# EAGLE design PIEFoundry 16-channel EIB (EAGLE 9.6.2)
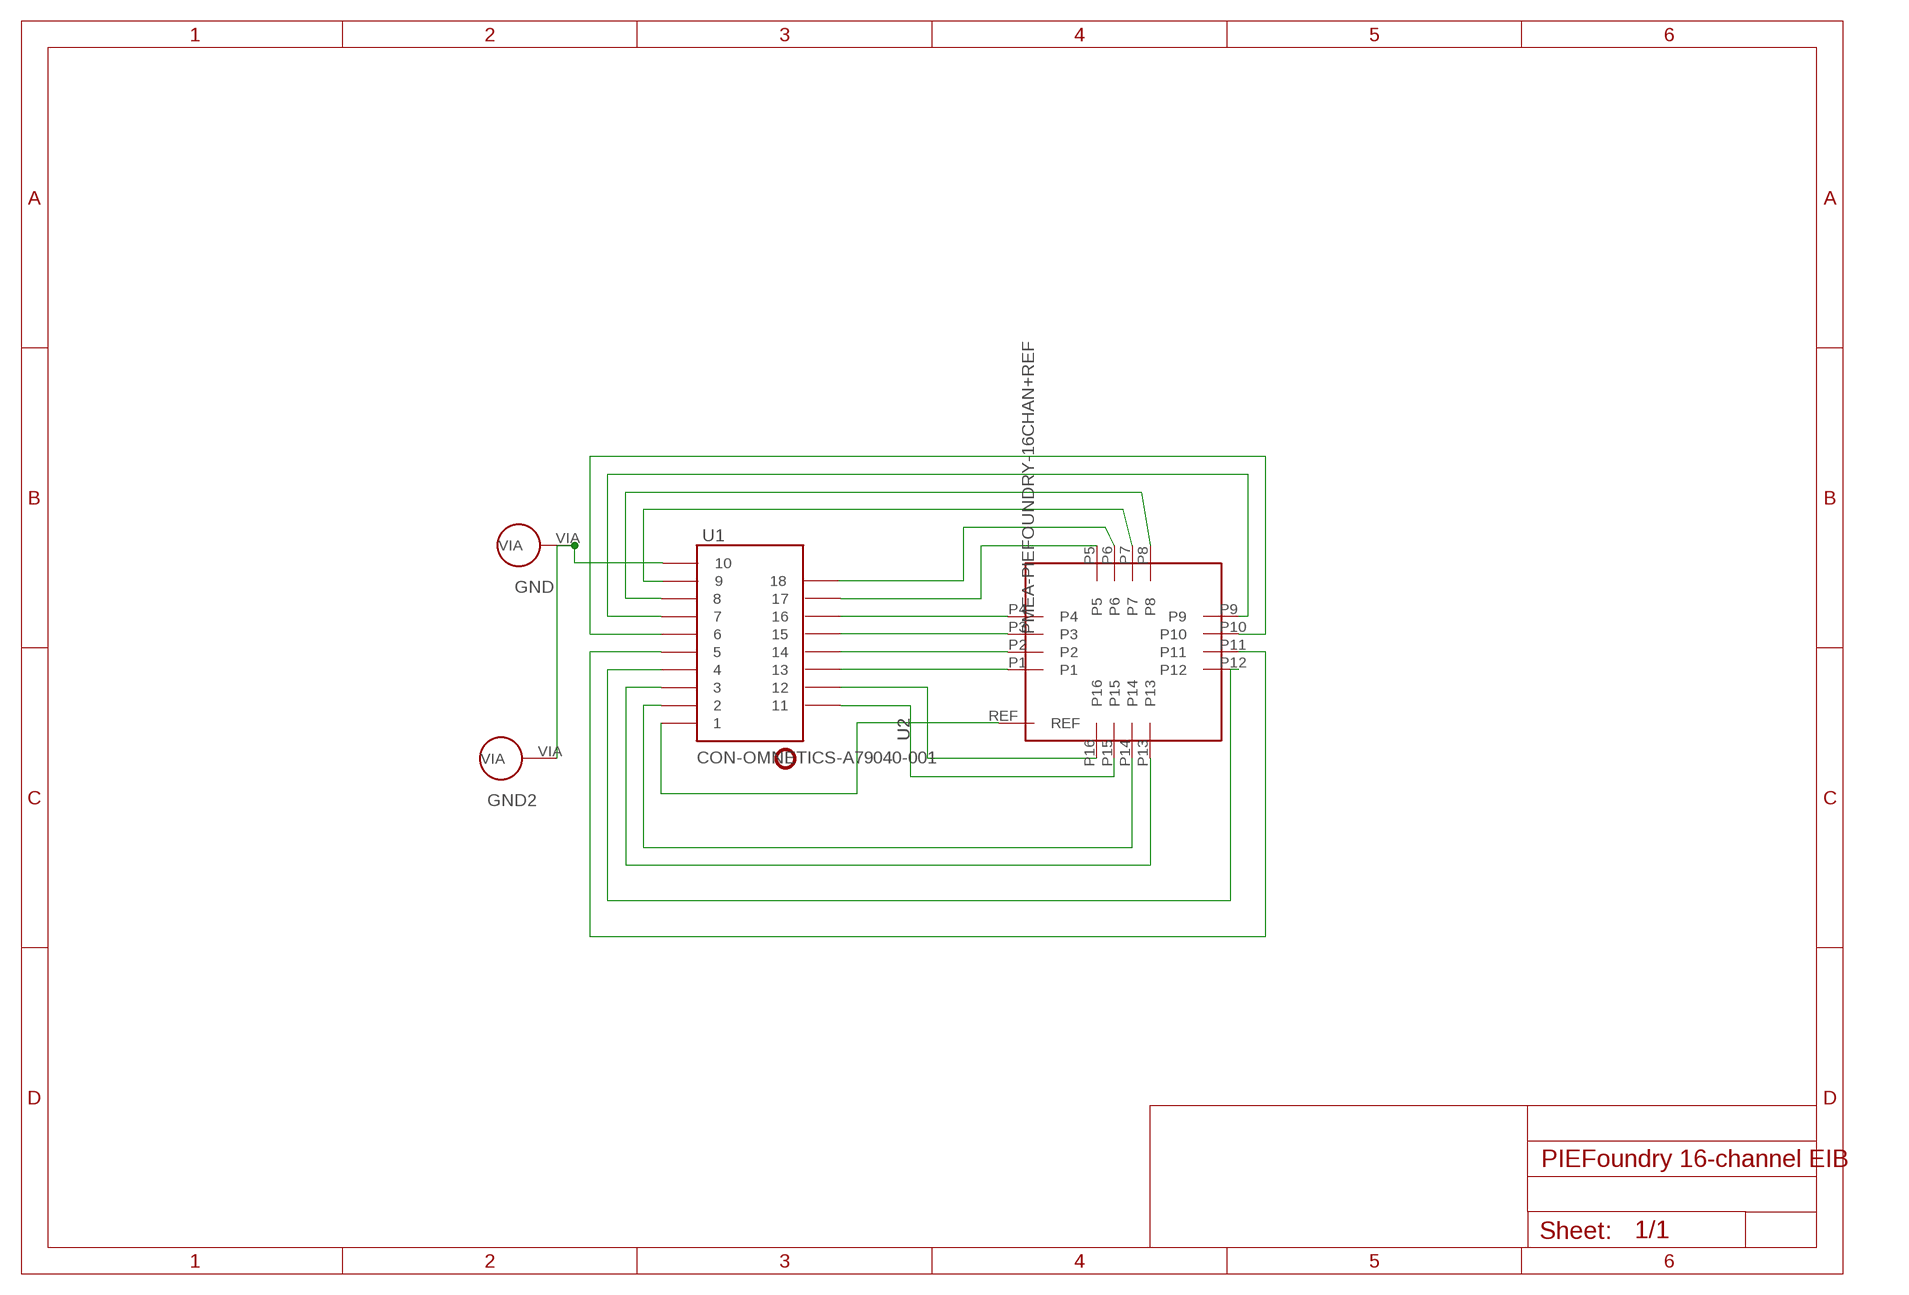
[diagram p0: schematic, sheet 1]

## Parts
GND  SOLDER_VIA_500_UM  [SOLDER_VIA_500_UM]
GND2  SOLDER_VIA_500_UM  [SOLDER_VIA_500_UM]
U1  CON-OMNETICS-A79040-001  [CON-OMNETICS-A79040-001]
U2  PMEA-PIEFOUNDRY-16CHAN+REF  [PMEA-PIEFOUNDRY-16CHAN+REF]

## Nets
GND: GND2.VIA GND.VIA U1.10
N$1: U1.13 U2.P1
N$2: U1.14 U2.P2
N$3: U1.15 U2.P3
N$4: U1.16 U2.P4
N$5: U1.12 U2.P16
N$6: U1.11 U2.P15
N$7: U1.17 U2.P5
N$8: U1.18 U2.P6
N$9: U1.2 U2.P14
N$10: U1.3 U2.P13
N$11: U1.8 U2.P8
N$12: U1.9 U2.P7
N$13: U1.4 U2.P12
N$14: U1.5 U2.P11
N$15: U1.6 U2.P10
N$16: U1.7 U2.P9
N$18: U1.1 U2.REF

## Library data of the parts
GND GND2 = VIA Connectors:SOLDER_VIA_500_UM: 500 um ID via for soldering leads
U1 = con-omnetics:CON-OMNETICS-A79040-001: 18 Position Dual Row Male Nano-Miniature (.025″/.64mm) Connector; Featuring 2 Guide Posts Holes and Horizontal Surface Mount Tails
U2 = pmea-piefoundry:PMEA-PIEFOUNDRY-16CHAN+REF: 16 channel polymer microelectrode array (pMEA) connector with integrated reference; Connection requires 17 wirebond (soft-gold) pads for ultrasonic bump bonding 3/25/25 Kee Scholten PIE Foundry @ USC

## Board
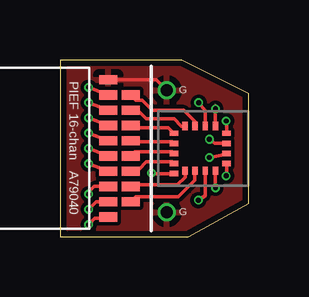
[diagram p1: board, top side]
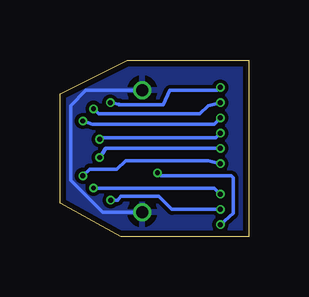
[diagram p2: board, bottom side, seen from below]

Size 7.87 x 7.37 mm. Coordinates in mm from the lower left corner, seen from the top.
Outline: 0,0 5.33,0 7.87,1.4 7.87,5.97 5.08,7.37 0,7.37 0,0
Copper layers (1*16): Top 0.035mm / dielectric 1.5mm / Bottom 0.035mm
Design rules "PIEF-11-28-23 design rules *": minimum track width 6mil, minimum drill 6mil, track to track 6mil, track to pad 6mil, pad to pad 6mil, via to via 6mil, smd to smd 6mil, copper to edge 10mil, drill to drill 15mil, minimum pad ring 3mil, minimum via ring 3mil, stop-mask expansion 4mil, vias tented up to drill 8mil, thermal gap 10mil

### Footprints (pad centres in the part's own frame; a part is rotated, then mirrored left to right if it is on the bottom)
SOLDER_VIA_500_UM = drill 0.5: VIA 0,0
CON-OMNETICS-A79040-001 = smd 0.762 x 0.381: 1 1.88,-2.857; 2 1.88,-2.223; 3 1.88,-1.587; 4 1.88,-0.953; 5 1.88,-0.318; 6 1.88,0.318; 7 1.88,0.953; 8 1.88,1.587; 9 1.88,2.223; 10 1.88,2.857; 11 2.819,-2.223; 12 2.819,-1.587; 13 2.819,-0.953; 14 2.819,-0.318; 15 2.819,0.318; 16 2.819,0.953; 17 2.819,1.587; 18 2.819,2.223
PMEA-PIEFOUNDRY-16CHAN+REF = smd 0.225 x 0.35: P1 -0.63,1.1; P2 -0.21,1.1; P3 0.21,1.1; P4 0.63,1.1; P9 0.63,-1.1; P10 0.21,-1.1; P11 -0.21,-1.1; P12 -0.63,-1.1; REF -1.05,1.1 | smd 0.35 x 0.225: P5 0.93,0.63; P6 0.93,0.21; P7 0.93,-0.21; P8 0.93,-0.63; P13 -0.93,-0.63; P14 -0.93,-0.21; P15 -0.93,0.21; P16 -0.93,0.63

### Placement (x,y rotation side)
GND  4.44,6.1 0 top
GND2  4.44,1.02 0 top
U1  0.13,3.68 0 top
U2  5.84,3.68 90 top

### Tracks (layer width: path | path; a pad name or v marks a point on that pad's centre or on a via)
GND
  Top 0.152: U1.10 4,6.54 GND.VIA
  Bottom 0.152: GND2.VIA 6.1,1.02 7.43,2.35 7.43,5.46 6.79,6.1 GND.VIA
  pour Top (isolate 0.076): 0,7.37 0,0 5.46,0 7.87,1.4 7.87,5.97 5.08,7.37
  pour Bottom (isolate 0.076): 0,7.37 0,0 5.33,0 7.87,1.4 7.87,5.97 5.08,7.37
N$1
  Top 0.152: U2.P1 4.68,3.12 3.59,3.12 3.29,2.82 3.16,2.82 3.07,2.73 U1.13
N$2
  Top 0.152: U2.P2 4.68,3.54 3.12,3.54 U1.14
N$3
  Top 0.152: U2.P3 4.68,3.96 2.99,3.96 U1.15
N$4
  Top 0.152: U2.P4 4.51,4.55 3.04,4.55 U1.16
N$5
  Top 0.152: U2.P16 5.21,2.49 4.88,2.17 3.02,2.17 U1.12
N$6
  Top 0.152: U2.P15 5.62,2.74 5.62,2.36 4.93,1.68 3.16,1.68 U1.11
N$7
  Top 0.152: U2.P5 5.05,4.61 4.76,4.91 3.6,4.91 3.24,5.27 U1.17
N$8
  Top 0.152: U2.P6 5.62,4.63 5.62,4.82 5.17,5.27 3.84,5.27 3.42,5.69 3.16,5.69 U1.18
N$9  (via drill 0.2)
  Top 0.152: v5.77,1.52 6.05,1.71 U2.P14 | v1.19,1.14 1.51,1.46 U1.2
  Bottom 0.152: v5.77,1.52 5.46,1.52 5.34,1.68 3.75,1.68 3.21,1.14 v1.19,1.14
N$10  (via drill 0.2)
  Top 0.152: U1.3 1.44,2.1 1.2,1.86 1.19,1.85 v1.19,1.78 | v6.48,2.03 v6.47,2.04 U2.P13
  Bottom 0.152: v1.19,1.78 1.45,2.03 v6.48,2.03
N$11  (via drill 0.2)
  Top 0.152: U1.8 v1.19,5.59 | v6.48,5.33 6.47,5.46 U2.P8
  Bottom 0.152: v6.48,5.33 6.26,5.12 2.04,5.12 1.7,5.46 v1.19,5.59
N$12  (via drill 0.2)
  Top 0.152: U1.9 v1.19,6.22 | v5.78,5.59 6.05,5.25 U2.P7
  Bottom 0.152: v1.19,6.22 1.32,6.1 3.29,6.1 3.58,5.49 5.43,5.49 5.4,5.52 v5.78,5.59
N$13  (via drill 0.2)
  Top 0.152: U1.4 v1.19,3.05 | v6.92,2.54 6.94,2.54 U2.P12
  Bottom 0.152: v1.19,3.05 1.7,3.17 5.14,3.17 5.5,2.82 6.64,2.82 v6.92,2.54
N$14  (via drill 0.2)
  Top 0.152: U1.5 v1.19,3.68 | v6.22,3.3 6.9,3.43 U2.P11
  Bottom 0.152: v6.22,3.3 5.97,3.68 1.57,3.68 v1.19,3.68
N$15  (via drill 0.2)
  Top 0.152: U1.6 v1.19,4.32 | v6.22,4.06 6.46,3.89 U2.P10
  Bottom 0.152: v1.19,4.32 1.38,4.13 6.18,4.13 v6.22,4.06
N$16  (via drill 0.2)
  Top 0.152: U1.7 v1.19,4.95 | v6.92,4.83 6.94,4.81 U2.P9
  Bottom 0.152: v6.92,4.83 6.54,4.7 1.45,4.7 v1.19,4.95
N$18  (via drill 0.2)
  Top 0.152: U2.REF 3.84,2.63 v3.81,2.66 | U1.1 1.94,0.76 1.45,0.76 v1.19,0.51
  Bottom 0.152: v1.19,0.51 0.66,0.97 0.66,2.45 0.74,2.54 3.68,2.54 v3.81,2.66

### Text on the board
tPlace: PIEF 16-chan A79040 | G | G